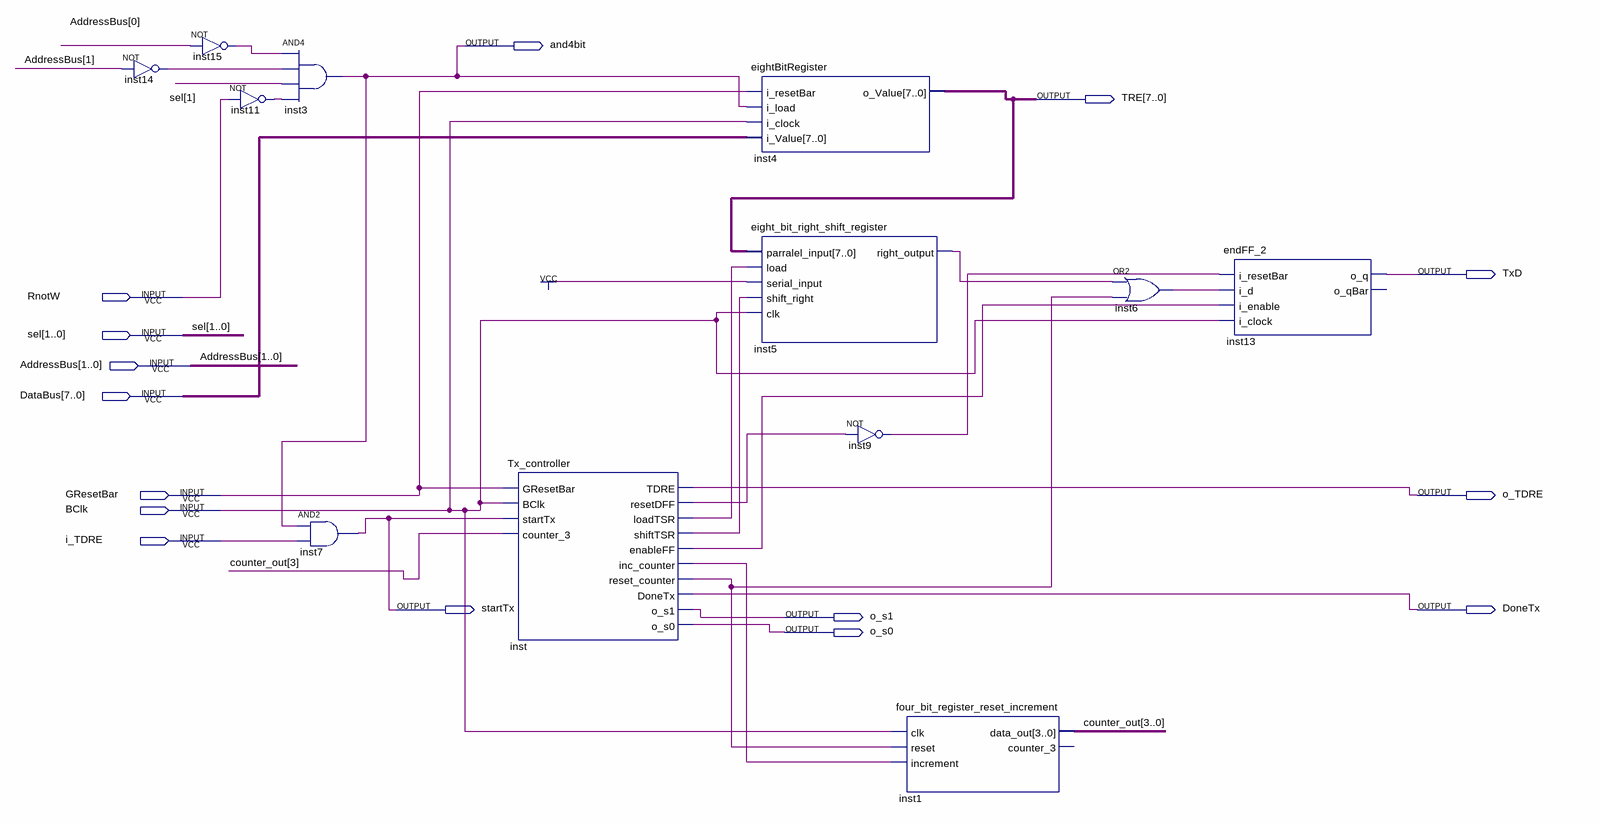
[diagram p0: schematic sheet]
// Quartus schematic TxDesign.bdf as structural Verilog: 12 symbols, 15 pins
module TxDesign (
  input  RnotW,
  input  [1:0] sel,
  input  [1:0] AddressBus,
  input  [7:0] DataBus,
  input  GResetBar,
  input  BClk,
  input  i_TDRE,
  output and4bit,
  output [7:0] TRE,
  output TxD,
  output o_TDRE,
  output startTx,
  output DoneTx,
  output o_s1,
  output o_s0
);

  wire inst5_right_output, inst6_out, inst9_out, inst11_out, inst14_out, inst15_out, inst_enableff,
       inst_inc_counter, inst_loadtsr, inst_reset_counter, inst_resetdff, inst_shifttsr;
  wire [3:0] counter_out;

  not inst14 (inst14_out, AddressBus[1]);
  not inst15 (inst15_out, AddressBus[0]);
  not inst11 (inst11_out, RnotW);
  and inst3 (and4bit, inst15_out, inst14_out, sel[1], inst11_out);
  and inst7 (startTx, and4bit, i_TDRE);
  Tx_controller inst (
    .GResetBar(GResetBar), .BClk(BClk), .startTx(startTx), .counter_3(counter_out[3]), .TDRE(o_TDRE),
    .resetDFF(inst_resetdff), .loadTSR(inst_loadtsr), .shiftTSR(inst_shifttsr), .enableFF(inst_enableff),
    .inc_counter(inst_inc_counter), .reset_counter(inst_reset_counter), .DoneTx(DoneTx), .o_s1(o_s1),
    .o_s0(o_s0));
  eightBitRegister inst4 (.i_resetBar(GResetBar), .i_load(and4bit), .i_clock(BClk), .i_Value(DataBus), .o_Value(TRE));
  eight_bit_right_shift_register inst5 (
    .parralel_input(TRE), .load(inst_loadtsr), .serial_input(1'b1), .shift_right(inst_shifttsr), .clk(BClk),
    .right_output(inst5_right_output));
  not inst9 (inst9_out, inst_resetdff);
  four_bit_register_reset_increment inst1 (
    .clk(BClk), .reset(inst_reset_counter), .increment(inst_inc_counter), .data_out(counter_out));  // open: counter_3
  or inst6 (inst6_out, inst5_right_output, inst_reset_counter);
  endFF_2 inst13 (
    .i_resetBar(inst9_out), .i_d(inst6_out), .i_enable(inst_enableff), .i_clock(BClk), .o_q(TxD));  // open: o_qBar
endmodule
